# EAGLE design LM324LevelSensor (EAGLE 9.5.2)
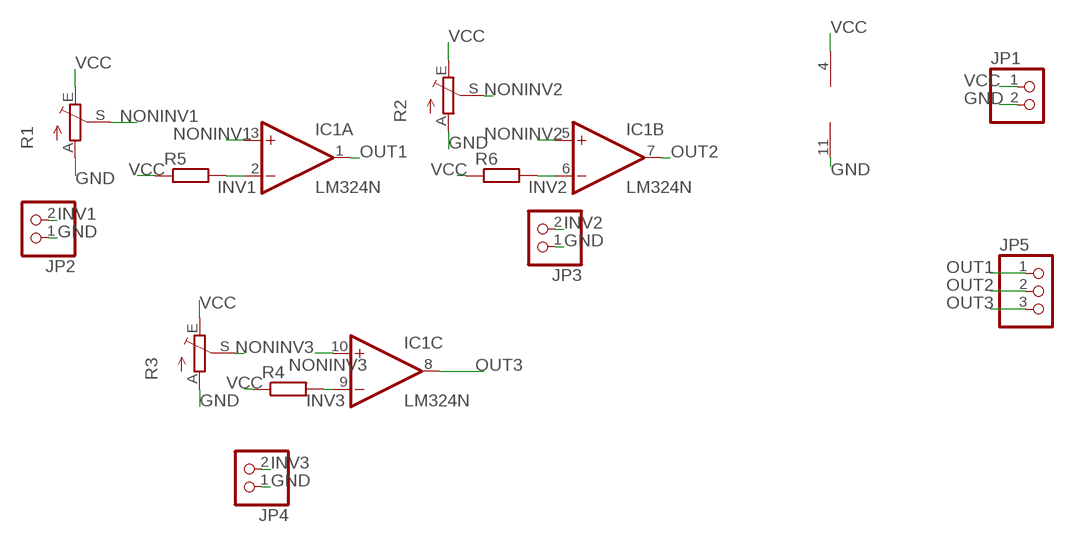
[diagram p0: schematic, sheet 1]

## Parts
IC1  LM324N  [DIL14]
JP1  PINHD-1X2  [1X02]
JP2  PINHD-1X2  [1X02]
JP3  PINHD-1X2  [1X02]
JP4  PINHD-1X2  [1X02]
JP5  PINHD-1X3  [1X03]
R1  TRIM_EU-B25P  [B25P]
R2  TRIM_EU-B25P  [B25P]
R3  TRIM_EU-B25P  [B25P]
R4  R-EU_0204/7  [0204/7]
R5  R-EU_0204/7  [0204/7]
R6  R-EU_0204/7  [0204/7]

## Nets
GND: IC1.11(P:V-) JP1.2 JP2.1 JP3.1 JP4.1 R1.A R2.A R3.A
INV1: IC1.2(A:-IN) JP2.2 R5.2
INV2: IC1.6(B:-IN) JP3.2 R6.2
INV3: IC1.9(C:-IN) JP4.2 R4.2
NONINV1: IC1.3(A:+IN) R1.S
NONINV2: IC1.5(B:+IN) R2.S
NONINV3: IC1.10(C:+IN) R3.S
OUT1: IC1.1(A:OUT) JP5.1
OUT2: IC1.7(B:OUT) JP5.2
OUT3: IC1.8(C:OUT) JP5.3
VCC: IC1.4(P:V+) JP1.1 R1.E R2.E R3.E R4.1 R5.1 R6.1
Unconnected: IC1.12(D:+IN) IC1.13(D:-IN) IC1.14(D:OUT)

## Library data of the parts
IC1 = linear:LM324: OP AMP
JP1-JP4 = pinhead:PINHD-1X2: PIN HEADER
JP5 = pinhead:PINHD-1X3: PIN HEADER
R1-R3 = pot:TRIM_EU-: POTENTIOMETER
R4-R6 = rcl:R-EU_: RESISTOR, European symbol; SPICEPREFIX: R

## Board
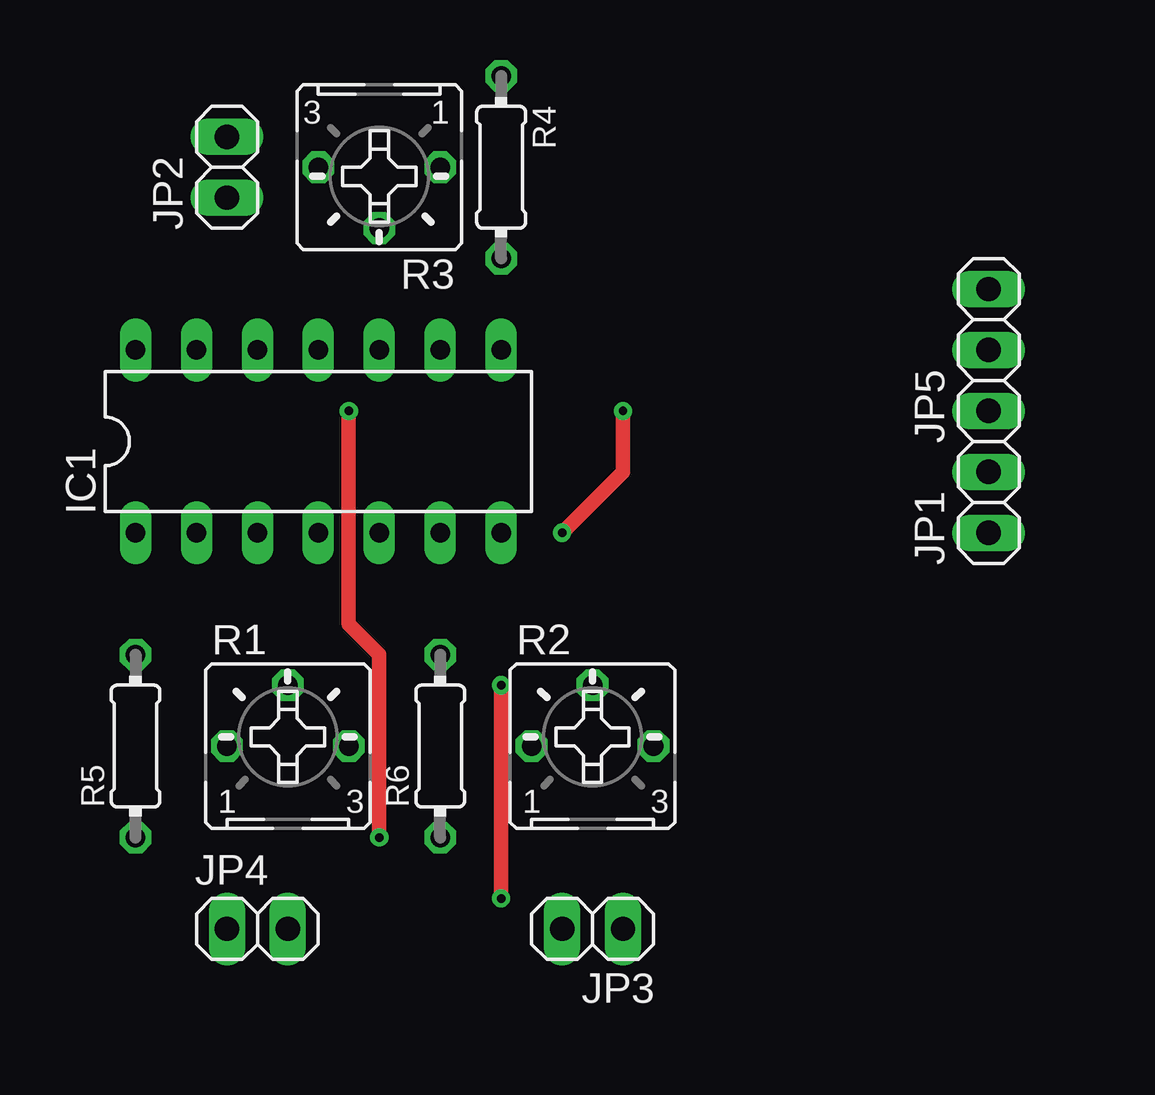
[diagram p1: board, top side]
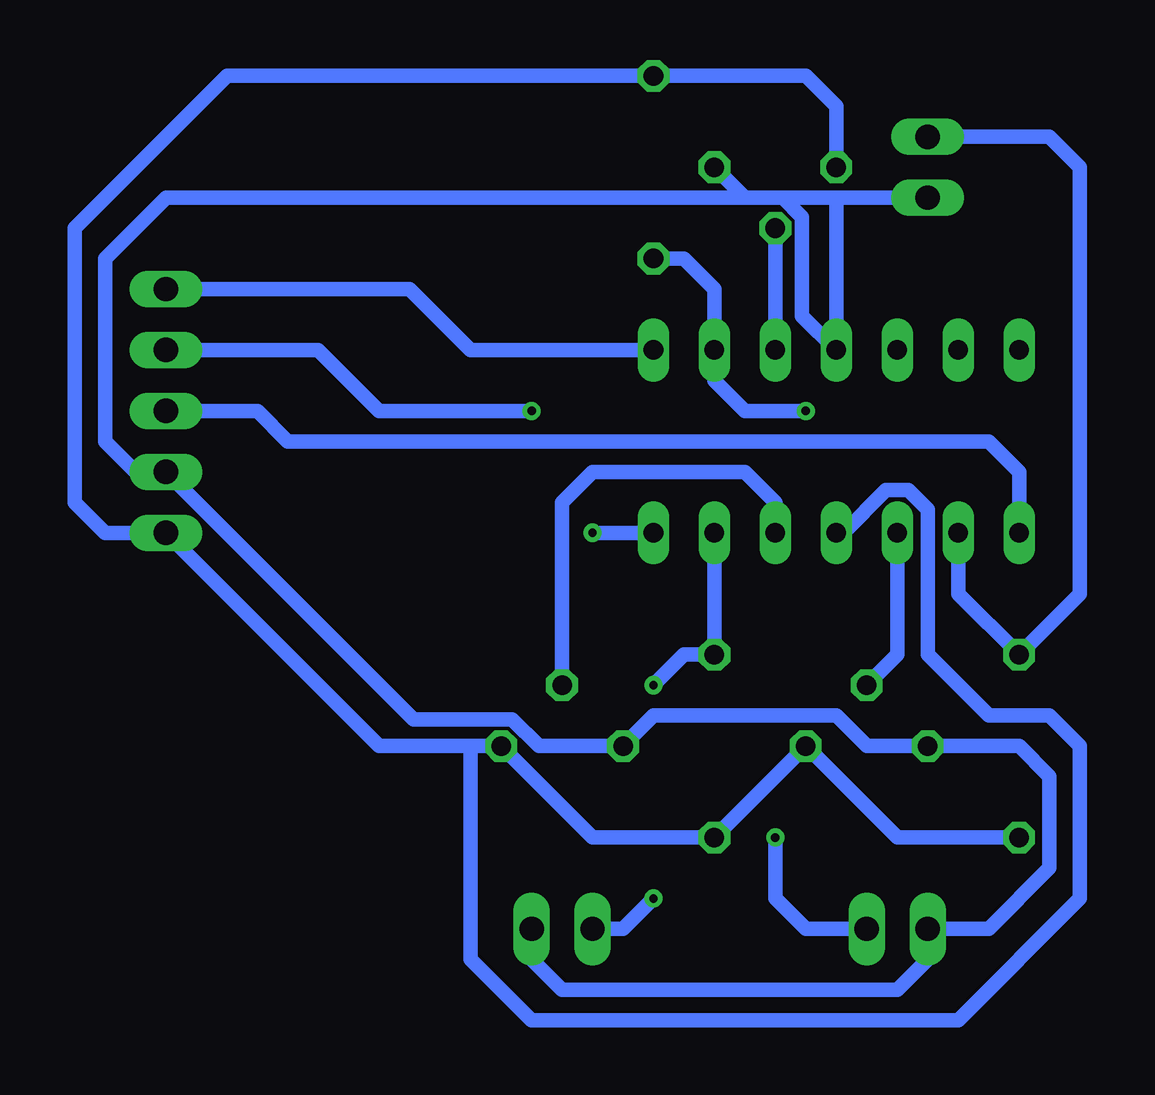
[diagram p2: board, bottom side, seen from below]

No outline drawn. Coordinates in mm, seen from the top.
Copper layers (1*16): Top 0.035mm / dielectric 1.5mm / Bottom 0.035mm
Design rules "default": minimum track width 6mil, minimum drill 0.35mm, track to track 6mil, track to pad 6mil, pad to pad 6mil, via to via 6mil, smd to smd 6mil, copper to edge 40mil, drill to drill 6mil, minimum pad ring 10mil, minimum via ring 8mil, stop-mask expansion 4mil, vias tented up to drill 0mil, thermal gap 10mil

### Footprints (pad centres in the part's own frame; a part is rotated, then mirrored left to right if it is on the bottom)
DIL14 = drill 0.813 long: 1 -7.62,-3.81; 2 -5.08,-3.81; 3 -2.54,-3.81; 4 0,-3.81; 5 2.54,-3.81; 6 5.08,-3.81; 7 7.62,-3.81; 8 7.62,3.81; 9 5.08,3.81; 10 2.54,3.81; 11 0,3.81; 12 -2.54,3.81; 13 -5.08,3.81; 14 -7.62,3.81
1X02 = drill 1.016 long: 1 -1.27,0; 2 1.27,0
1X03 = drill 1.016 long: 1 -2.54,0; 2 0,0; 3 2.54,0
B25P = drill 0.813 octagon: A -2.54,0; E 2.54,0; S 0,2.54
0204/7 = drill 0.813 octagon: 1 -3.81,0; 2 3.81,0

### Placement (x,y rotation side)
IC1  30.48,-16.51 0 top
JP1  58.42,-19.05 90 top
JP2  26.67,-5.08 90 top
JP3  41.91,-36.83 180 top
JP4  27.94,-36.83 0 top
JP5  58.42,-12.7 90 top
R1  29.21,-29.21 0 top
R2  41.91,-29.21 0 top
R3  33.02,-5.08 180 top
R4  38.1,-5.08 270 top
R5  22.86,-29.21 90 top
R6  35.56,-29.21 90 top

### Tracks (layer width: path | path; a pad name or v marks a point on that pad's centre or on a via)
GND
  Bottom 0.61: R3.A 34.29,-6.35 30.48,-6.35 | 30.48,-6.35 JP2.1 | 30.48,-6.35 IC1.11 31.9,-11.28 31.9,-7.16 32.71,-6.35 58.42,-6.35 60.96,-8.89 60.96,-16.51 59.69,-17.78 JP1.2 48.11,-28.09 43.99,-28.09 42.87,-29.21 R2.A 38.1,-27.94 30.48,-27.94 29.21,-29.21 R1.A 22.86,-29.21 21.59,-30.48 21.59,-34.29 24.13,-36.83 JP4.1 26.67,-38.1 27.94,-39.37 41.91,-39.37 43.18,-38.1 JP3.1
INV1
  Bottom 0.61: IC1.2 25.4,-22.86 R5.2 20.32,-22.86 20.32,-5.08 21.59,-3.81 JP2.2
INV2  (via drill 0.35)
  Top 0.61: v38.1,-35.56 v38.1,-26.67
  Bottom 0.61: IC1.6 R6.2 36.83,-25.4 v38.1,-26.67 | JP3.2 39.37,-36.83 v38.1,-35.56
INV3  (via drill 0.35)
  Top 0.61: v33.02,-33.02 33.02,-25.4 31.75,-24.13 v31.75,-15.24
  Bottom 0.61: R4.2 36.83,-8.89 35.56,-10.16 IC1.9 35.56,-13.97 34.29,-15.24 v31.75,-15.24 | v33.02,-33.02 33.02,-35.56 31.75,-36.83 JP4.2
NONINV1
  Bottom 0.61: R1.S 27.94,-25.4 IC1.3
NONINV2
  Bottom 0.61: IC1.5 33.02,-19.05 34.29,-17.78 40.64,-17.78 41.91,-19.05 R2.S
NONINV3
  Bottom 0.61: IC1.10 R3.S
OUT1
  Bottom 0.61: JP5.1 54.61,-15.24 53.34,-16.51 24.13,-16.51 22.86,-17.78 IC1.1
OUT2  (via drill 0.35)
  Top 0.61: v43.18,-15.24 43.18,-17.78 v40.64,-20.32
  Bottom 0.61: JP5.2 52.07,-12.7 49.53,-15.24 v43.18,-15.24 | v40.64,-20.32 IC1.7
OUT3
  Bottom 0.61: IC1.8 45.72,-12.7 48.26,-10.16 JP5.3
VCC
  Bottom 0.61: R5.1 27.94,-33.02 R1.E R6.1 40.64,-33.02 R2.E 45.72,-29.21 | 45.72,-29.21 49.53,-29.21 JP1.1 60.96,-20.32 62.23,-19.05 62.23,-7.62 55.88,-1.27 R4.1 31.75,-1.27 30.48,-2.54 R3.E | IC1.4 30.18,-20.32 28.4,-18.54 27.48,-18.54 26.67,-19.35 26.67,-25.4 24.13,-27.94 21.59,-27.94 20.32,-29.21 20.32,-35.56 25.4,-40.64 43.18,-40.64 45.72,-38.1 45.72,-29.21